# EAGLE design plant-sensor (EAGLE 9.5.1)
DESIGNER: Sander Huisman; PROJECT_NAME: Plant Sensor

## Sheet 1 of 5: Power
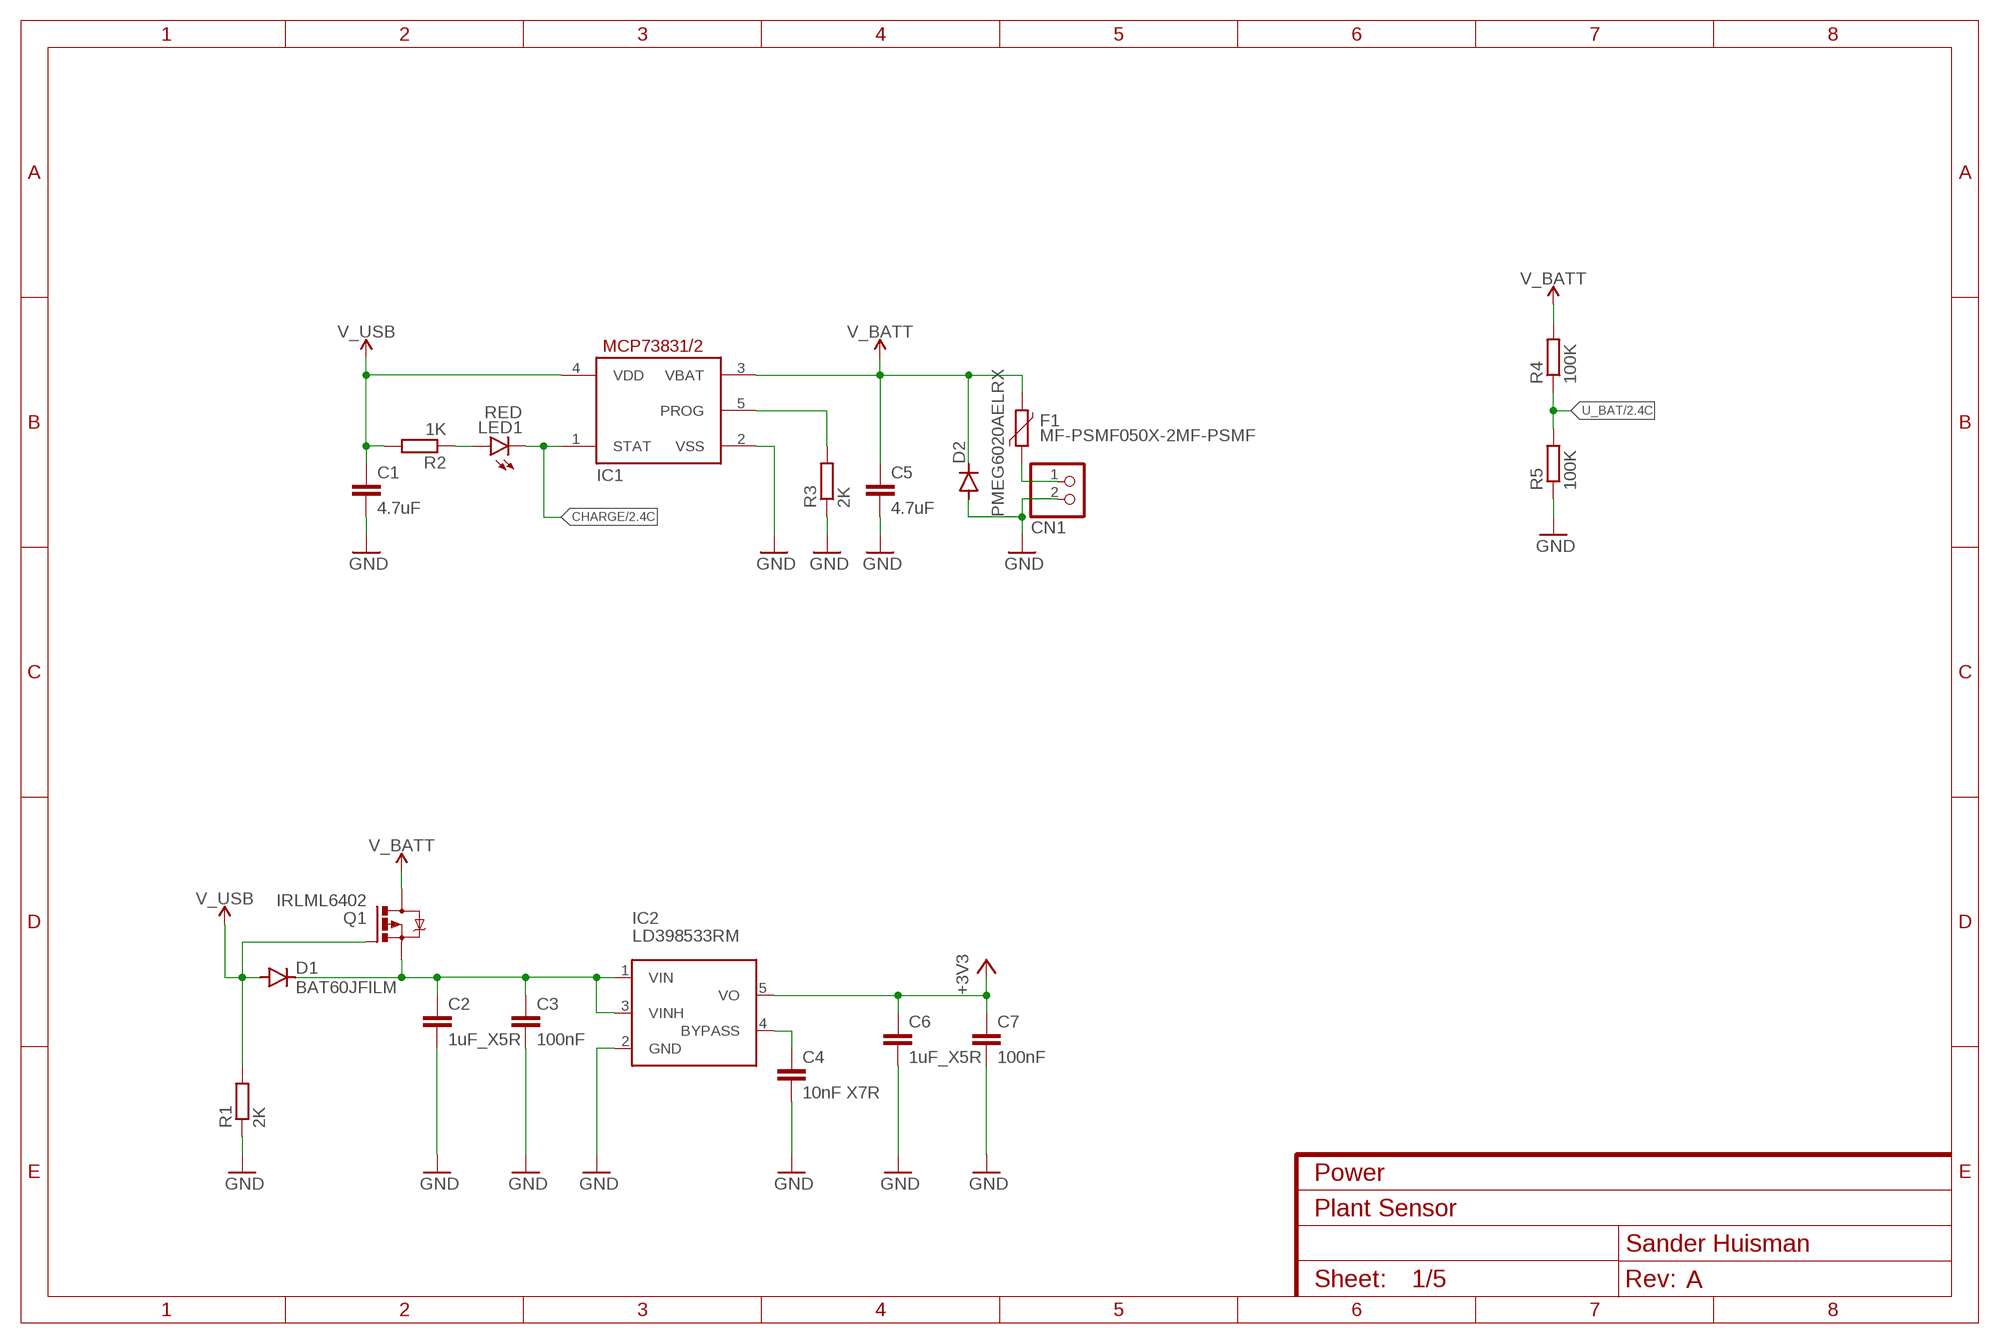
[diagram p0: schematic, sheet 1]
FRAME1 (FRAME-A4L): CNAME: Power; CREVISION: A

### Parts
C1  4.7uF  C-EUC0805  [C0805]
C2  1uF_X5R  C-EUC0805  [C0805]
C3  100nF  C-EUC0805  [C0805]
C4  10nF X7R  C-EUC0805  [C0805]
C5  4.7uF  C-EUC0805  [C0805]
C6  1uF_X5R  C-EUC0805  [C0805]
C7  100nF  C-EUC0805  [C0805]
CN1  JST_2PIN-SMT-RA  [JST-PH-2-SMT-RA]
D1  BAT60JFILM  DIODE-SOD323-W  [SOD323-W]
D2  PMEG6020AELRX  DIODE-SOD123  [SOD123]
F1  MF-PSMF050X-2MF-PSMF  [R0805]
IC1  MCP73831/OT  [SOT23-5L]
IC2  LD398533RM  [SOT23-5L]
LED1  RED  LEDCHIP-LED0805  [CHIP-LED0805]
Q1  IRLML6402  IRLML5203  [MICRO3]
R1  2K  R-EU_R0805  [R0805]
R2  1K  R-EU_R0805  [R0805]
R3  2K  R-EU_R0805  [R0805]
R4  100K  R-EU_R0805  [R0805]
R5  100K  R-EU_R0805  [R0805]

### Nets
+3V3: C6.1 C7.1 IC2.5(VO) ; also sheet 2,3,4
CHARGE [gnd]: IC1.1(STAT) LED1.C ; also sheet 2
GND [gnd]: C1.2 C2.2 C3.2 C4.2 C5.2 C6.2 C7.2 CN1.2 D2.A IC1.2(VSS) IC2.2(GND) R1.1 R3.1 R5.1 ; also sheet 2,3,4,5
N$2: CN1.1 F1.1
N$3: C2.1 C3.1 D1.C IC2.1(VIN) IC2.3(VINH) Q1.2(S)
N$4: LED1.A R2.1
N$5: IC1.5(PROG) R3.2
N$102: C4.1 IC2.4(BYPASS)
U_BAT: R4.1 R5.2 ; also sheet 2
V_BATT: C5.1 D2.C F1.2 IC1.3(VBAT) Q1.3(D) R4.2
V_USB: C1.1 D1.A IC1.4(VDD) Q1.1(G) R1.2 R2.2 ; also sheet 5

## Sheet 2 of 5: MCU
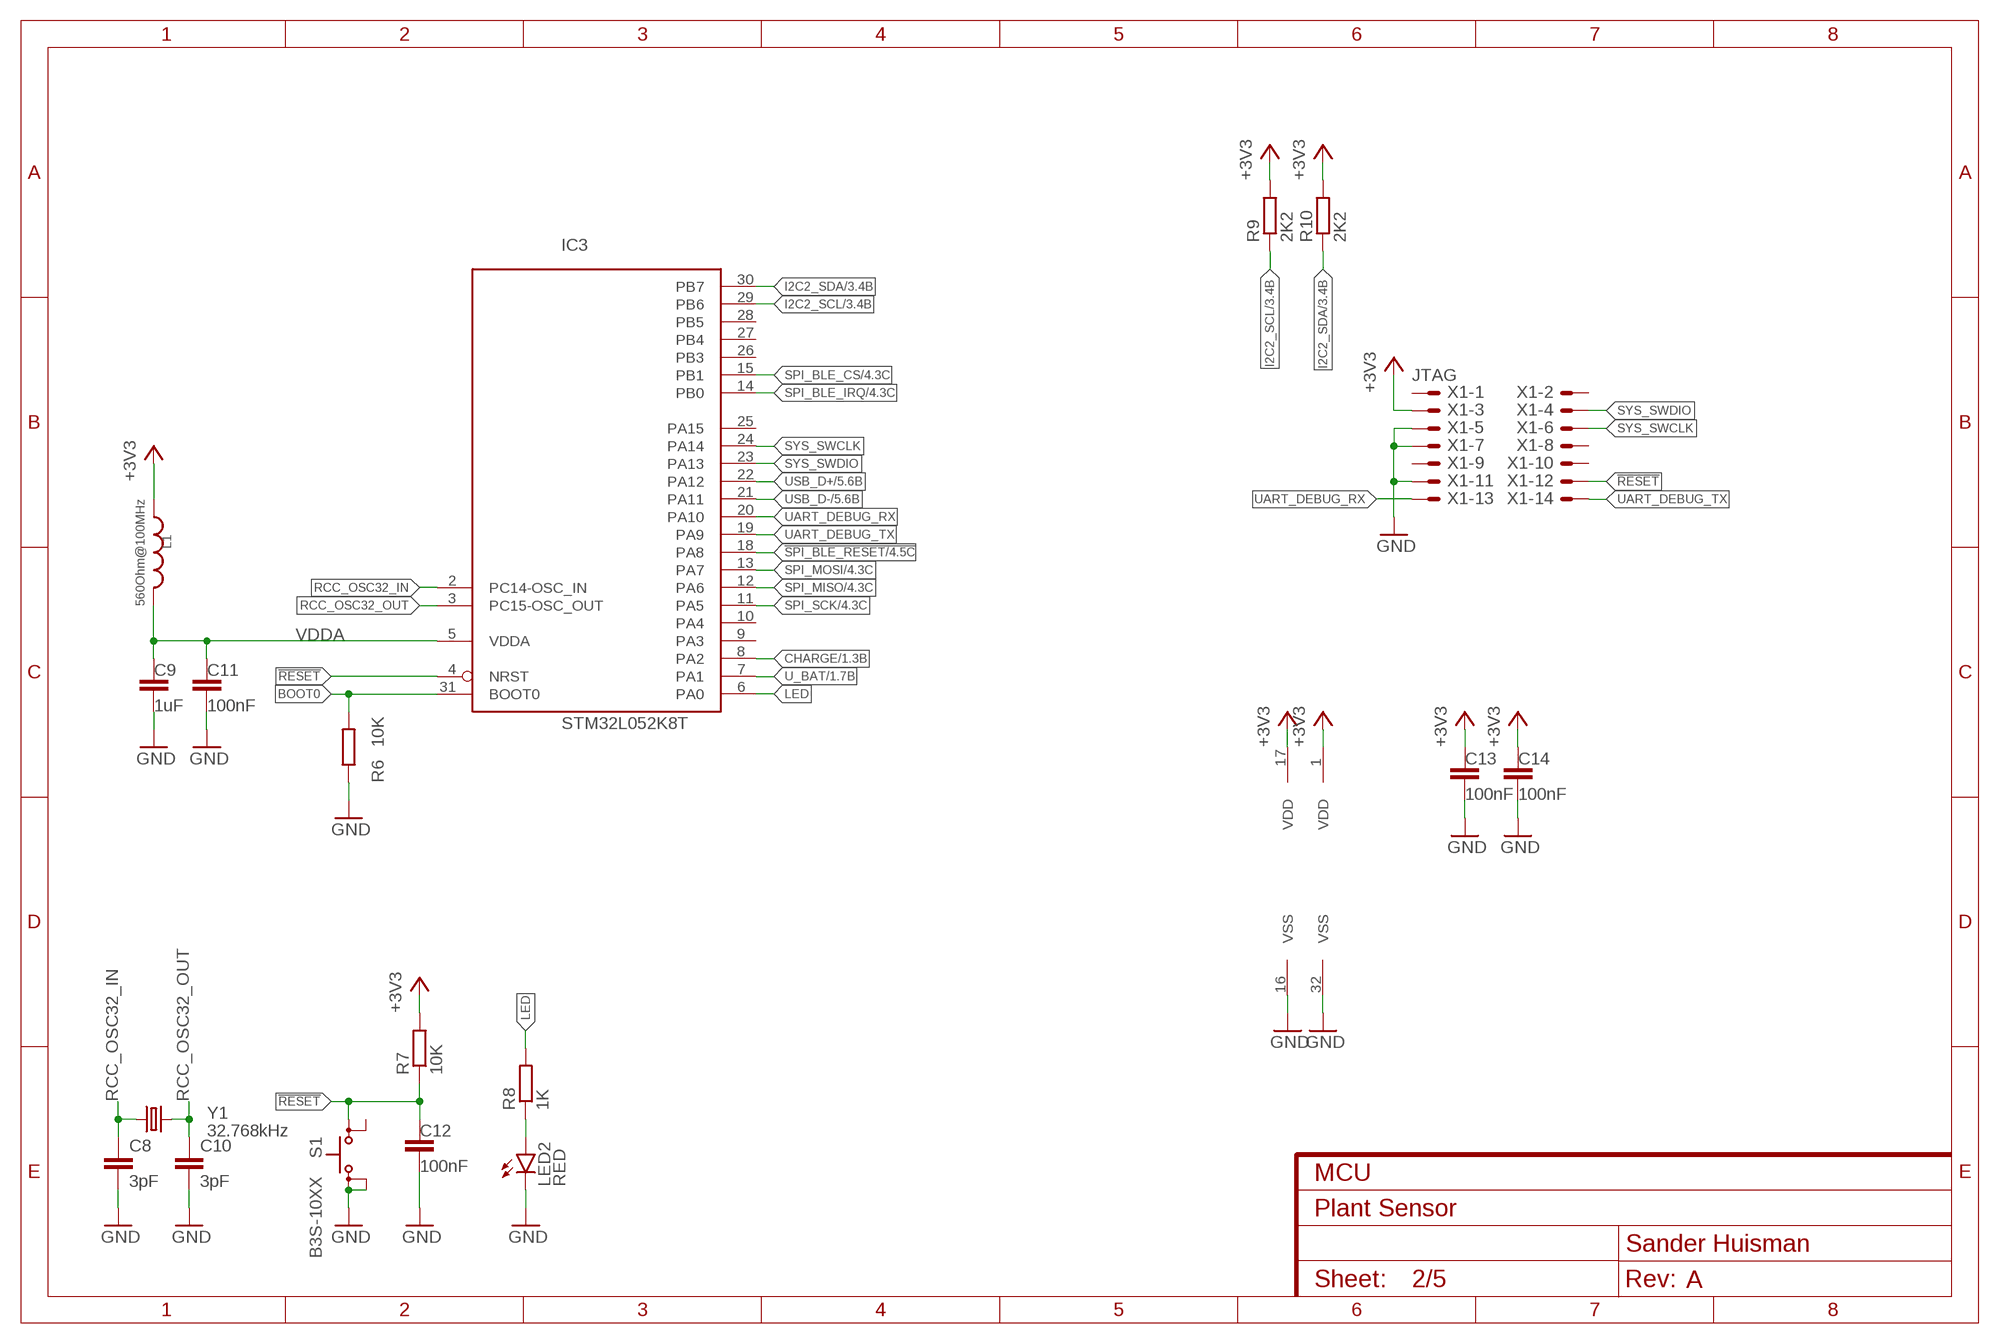
[diagram p1: schematic, sheet 2]
FRAME2 (FRAME-A4L): CNAME: MCU; CREVISION: A

### Parts
C8  3pF  C-EUC0805  [C0805]
C9  1uF  C-EUC0805  [C0805]
C10  3pF  C-EUC0805  [C0805]
C11  100nF  C-EUC0805  [C0805]
C12  100nF  C-EUC0805  [C0805]
C13  100nF  C-EUC0805  [C0805]
C14  100nF  C-EUC0805  [C0805]
IC3  STM32L052K8T  [LQFP32]
L1  560Ohm@100MHz  WE-CBA_0805_782853561_HC  [WE-CBA_0805(W=4)]
LED2  RED  LEDCHIP-LED0805  [CHIP-LED0805]
R6  10K  R-EU_R0805  [R0805]
R7  10K  R-EU_R0805  [R0805]
R8  1K  R-EU_R0805  [R0805]
R9  2K2  R-EU_R0805  [R0805]
R10  2K2  R-EU_R0805  [R0805]
S1  B3S-10XX  [B3S-10XX]
X1  JTAG  1365-14  [1365-14]
Y1  32.768kHz  ABS25-32.768KHZ-6-1-T  [XTAL_ABS25-32.768KHZ-6-1-T]

### Nets
!RESET: C12.2 IC3.4(NRST) R7.1 S1.1(P) X1.12
!SPI_BLE_RESET: IC3.18(PA8) ; also sheet 4
+3V3: C13.2 C14.2 IC3.17(VDD) L1.1 R7.2 R9.2 R10.2 X1.3 ; also sheet 1,3,4
BOOT0: IC3.31(BOOT0) R6.2
CHARGE [gnd]: IC3.8(PA2) ; also sheet 1
GND [gnd]: C8.2 C9.1 C10.2 C11.1 C12.1 C13.1 C14.1 IC3.16(VSS) IC3.32(VSS) LED2.C R6.1 S1.3(S) S1.4(S1) X1.5 X1.7 X1.11 ; also sheet 1,3,4,5
I2C2_SCL: IC3.29(PB6) R9.1 ; also sheet 3
I2C2_SDA: IC3.30(PB7) R10.1 ; also sheet 3
LED: IC3.6(PA0) R8.2
N$1: IC3.1(VDD) ; supply symbol labelled +3V3
N$9: LED2.A R8.1
RCC_OSC32_IN: C8.1 IC3.2(PC14-OSC_IN) Y1.1
RCC_OSC32_OUT: C10.1 IC3.3(PC15-OSC_OUT) Y1.4
SPI_BLE_CS: IC3.15(PB1) ; also sheet 4
SPI_BLE_IRQ: IC3.14(PB0) ; also sheet 4
SPI_MISO: IC3.12(PA6) ; also sheet 4
SPI_MOSI: IC3.13(PA7) ; also sheet 4
SPI_SCK: IC3.11(PA5) ; also sheet 4
SYS_SWCLK: IC3.24(PA14) X1.6
SYS_SWDIO: IC3.23(PA13) X1.4
U_BAT: IC3.7(PA1) ; also sheet 1
UART_DEBUG_RX: IC3.20(PA10) X1.13
UART_DEBUG_TX: IC3.19(PA9) X1.14
USB_D+ [usb]: IC3.22(PA12) ; also sheet 5
USB_D- [usb]: IC3.21(PA11) ; also sheet 5
VDDA: C9.2 C11.2 IC3.5(VDDA) L1.2
Unconnected: IC3.9(PA3) IC3.10(PA4) IC3.25(PA15) IC3.26(PB3) IC3.27(PB4) IC3.28(PB5) S1.2(P1) X1.1 X1.2 X1.8 X1.9 X1.10

## Sheet 3 of 5: Sensors
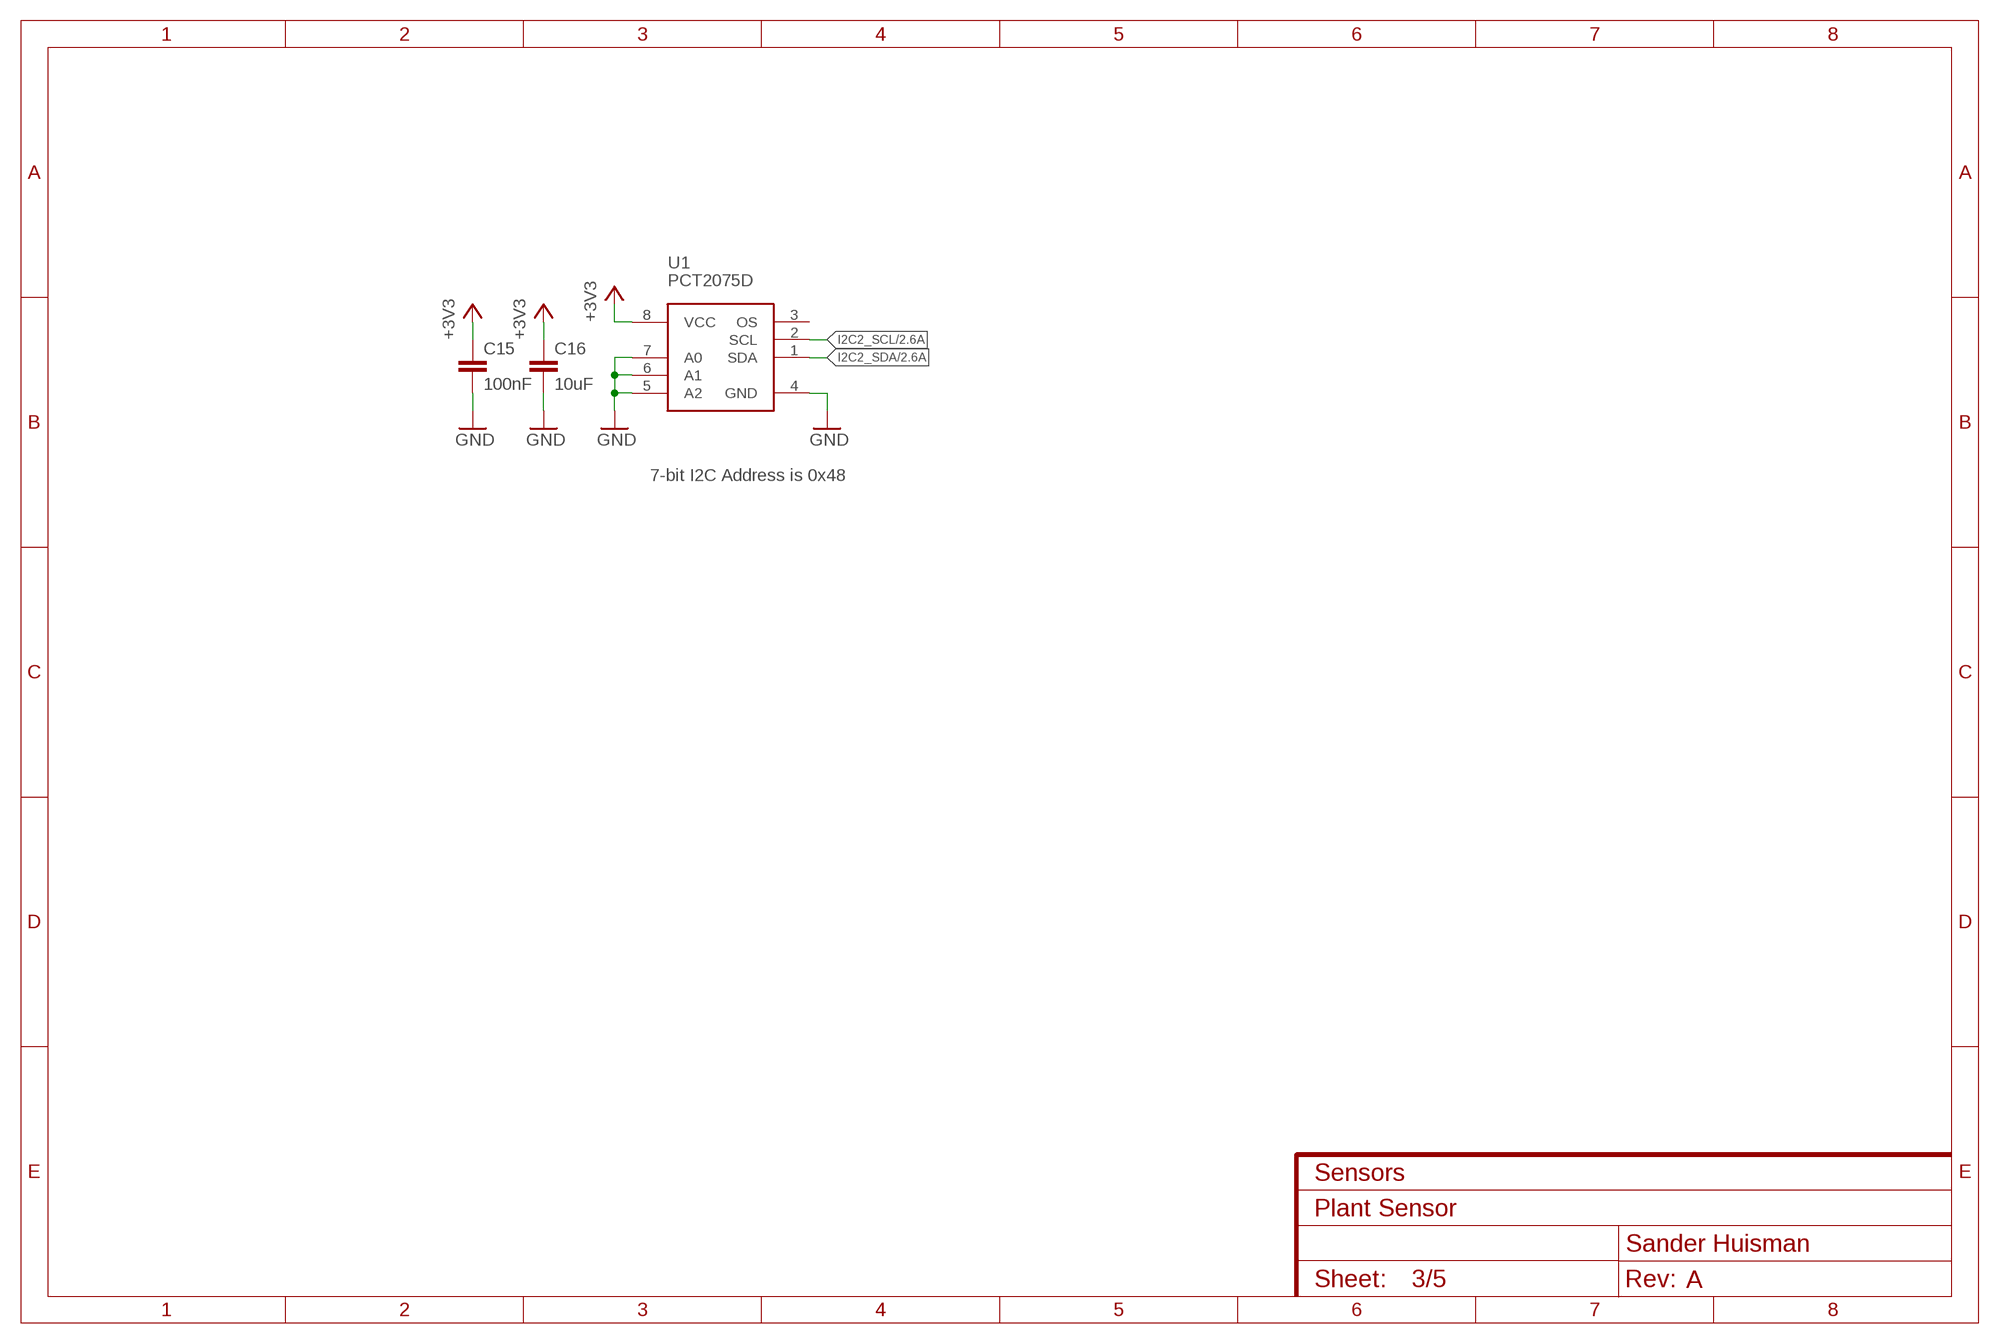
[diagram p2: schematic, sheet 3]
FRAME3 (FRAME-A4L): CNAME: Sensors; CREVISION: A

### Parts
C15  100nF  C-EUC0805  [C0805]
C16  10uF  C-EUC0805  [C0805]
U1  PCT2075D  [SOIC8_150MIL]

### Nets
+3V3: C15.1 C16.1 U1.8(VCC) ; also sheet 1,2,4
GND [gnd]: C15.2 C16.2 U1.4(GND) U1.5(A2) U1.6(A1) U1.7(A0) ; also sheet 1,2,4,5
I2C2_SCL: U1.2(SCL) ; also sheet 2
I2C2_SDA: U1.1(SDA) ; also sheet 2
Unconnected: U1.3(OS)

### Notes on the sheet
- 7-bit I2C Address is 0x48

## Sheet 4 of 5: BLE
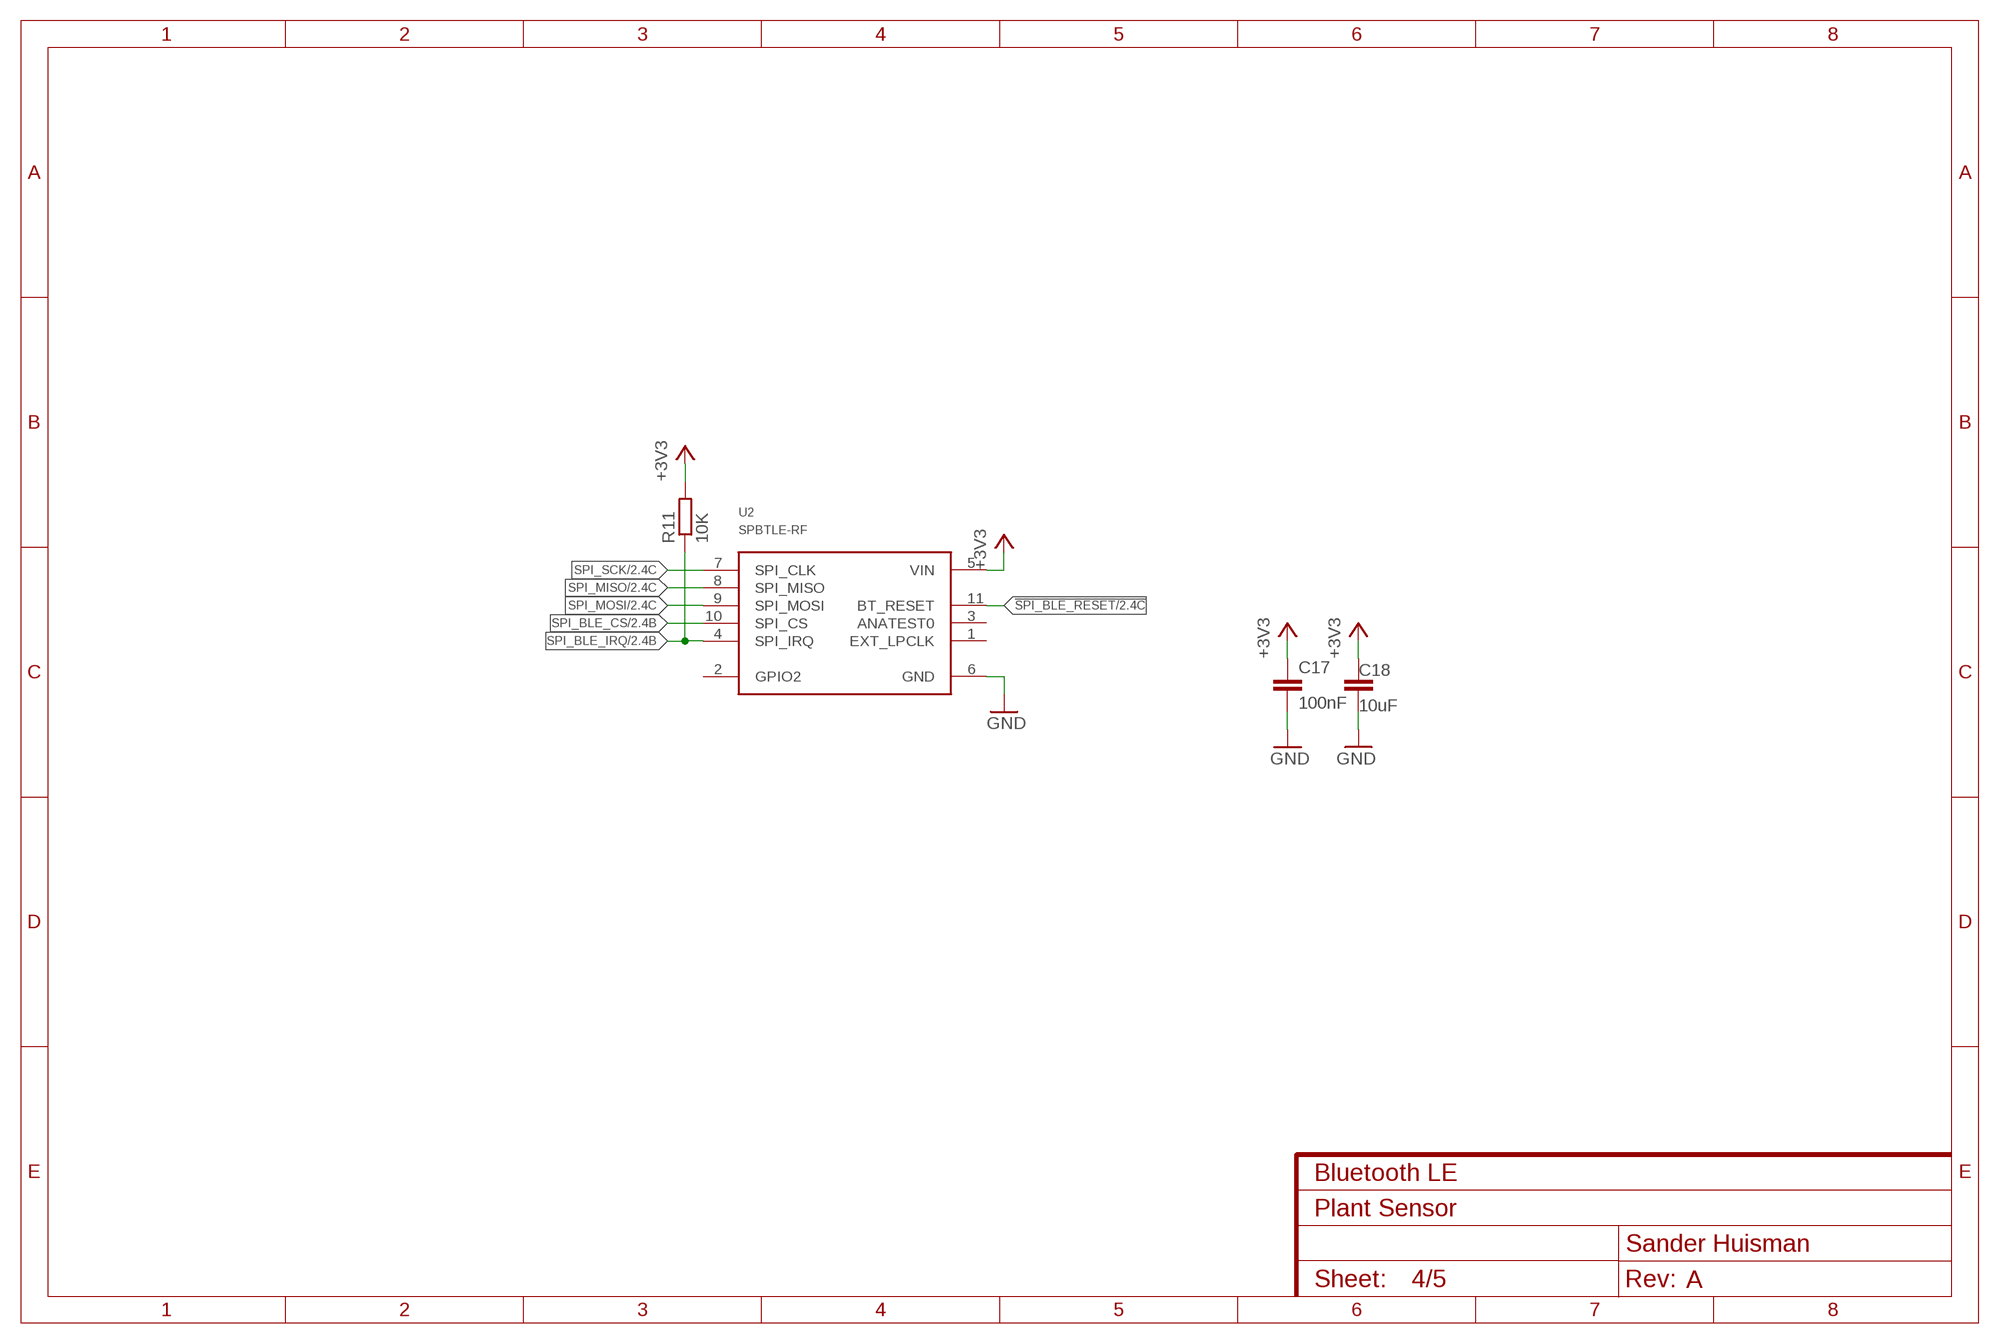
[diagram p3: schematic, sheet 4]
FRAME4 (FRAME-A4L): CNAME: Bluetooth LE; CREVISION: A

### Parts
C17  100nF  C-EUC0805  [C0805]
C18  10uF  C-EUC0805  [C0805]
R11  10K  R-EU_R0805  [R0805]
U2  SPBTLE-RF  [XCVR_SPBTLE-RF]

### Nets
!SPI_BLE_RESET: U2.11(BT_RESET) ; also sheet 2
+3V3: C17.1 C18.2 R11.2 U2.5(VIN) ; also sheet 1,2,3
GND [gnd]: C17.2 C18.1 U2.6(GND) ; also sheet 1,2,3,5
SPI_BLE_CS: U2.10(SPI_CS) ; also sheet 2
SPI_BLE_IRQ: R11.1 U2.4(SPI_IRQ) ; also sheet 2
SPI_MISO: U2.8(SPI_MISO) ; also sheet 2
SPI_MOSI: U2.9(SPI_MOSI) ; also sheet 2
SPI_SCK: U2.7(SPI_CLK) ; also sheet 2
Unconnected: U2.1(EXT_LPCLK) U2.2(GPIO2) U2.3(ANATEST0)

## Sheet 5 of 5: USB
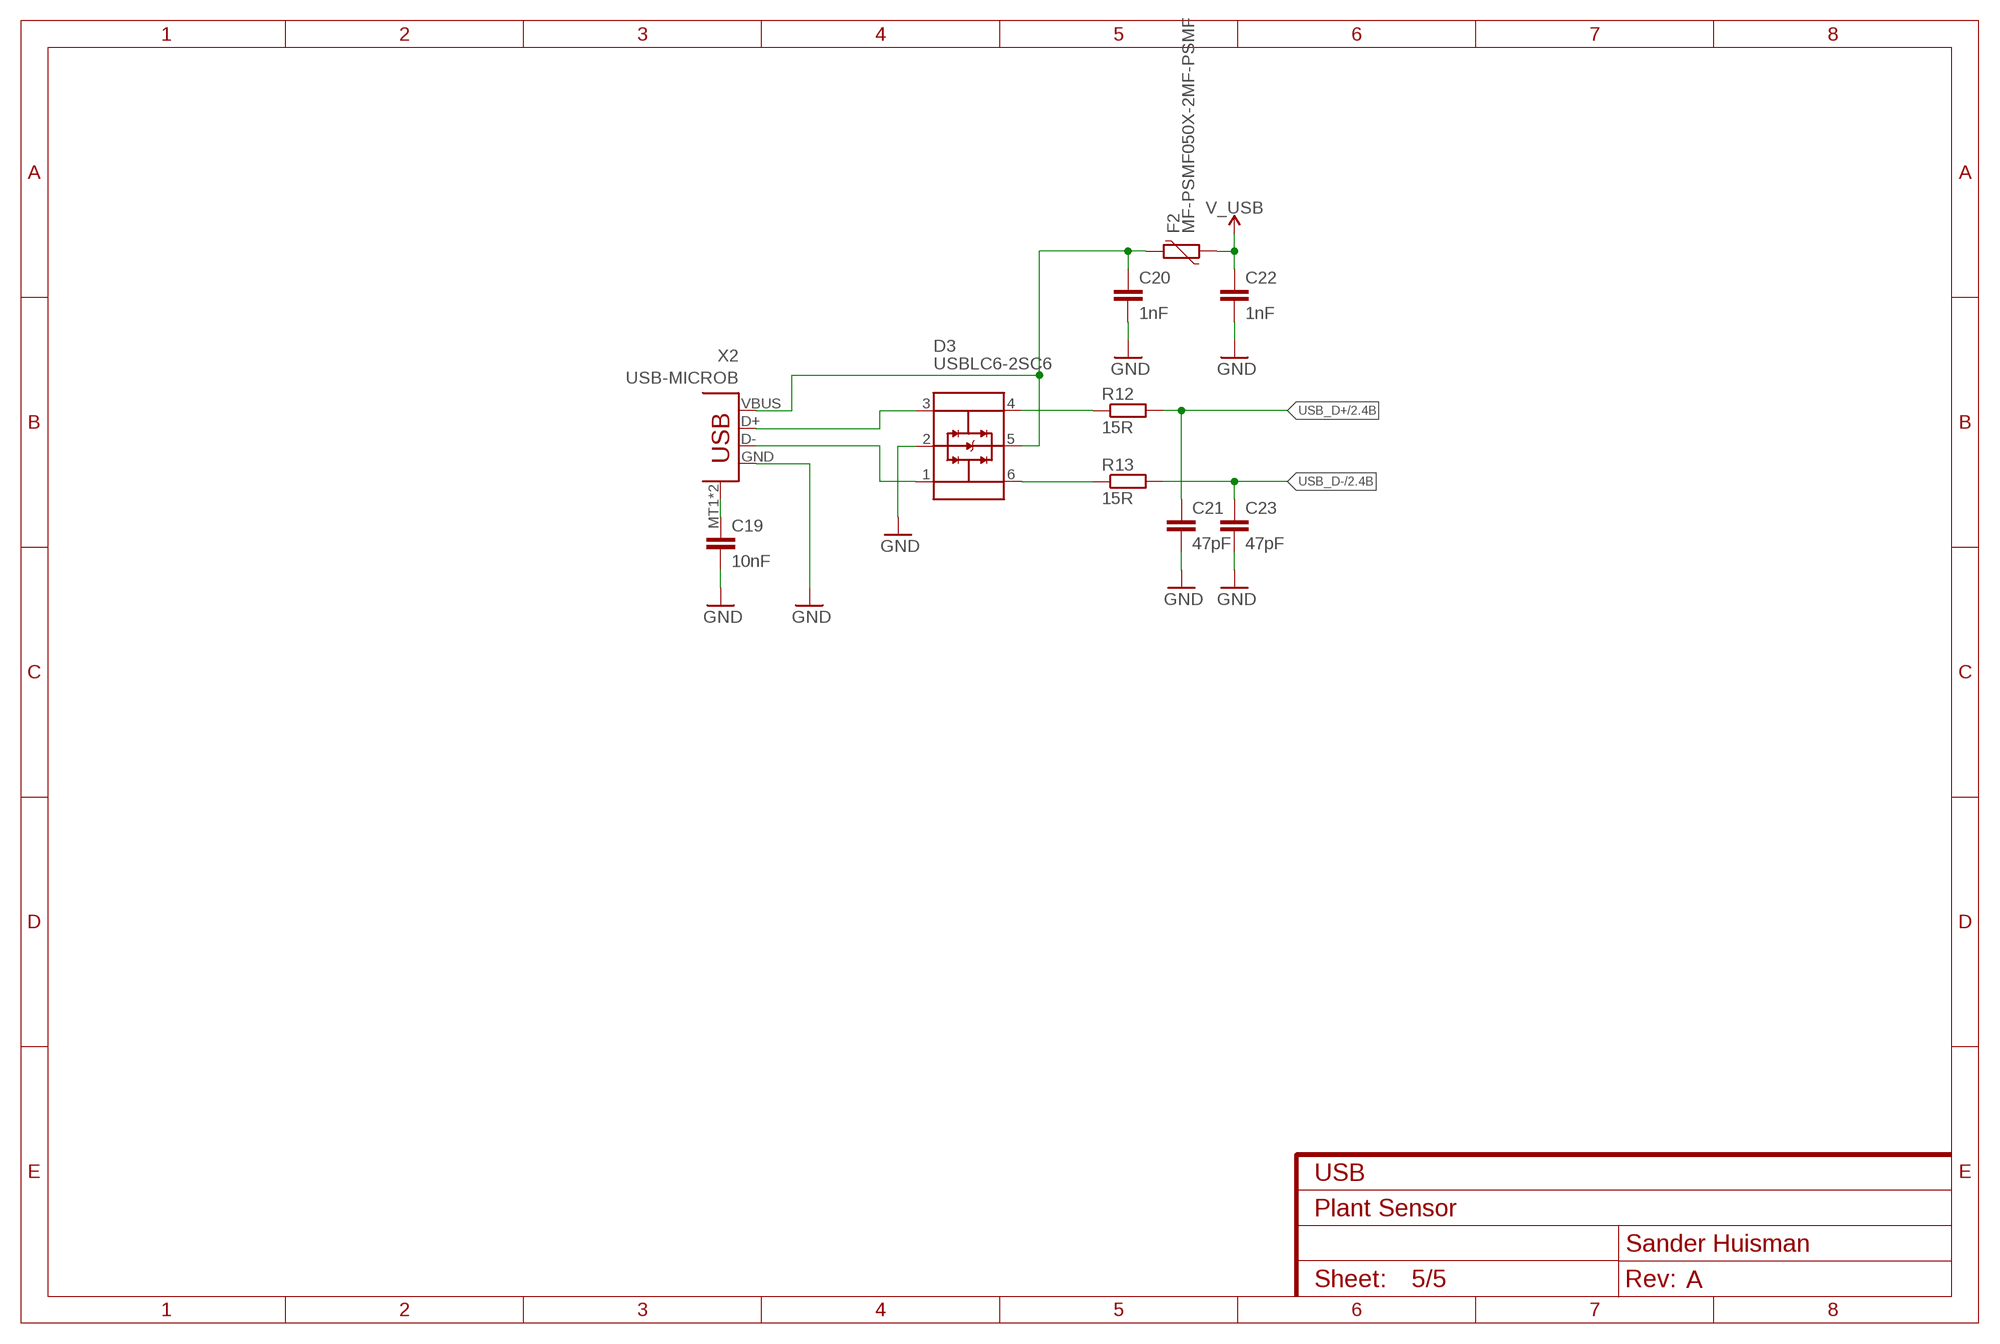
[diagram p4: schematic, sheet 5]
FRAME5 (FRAME-A4L): CNAME: USB; CREVISION: A

### Parts
C19  10nF  C-EUC0805  [C0805]
C20  1nF  C-EUC0805  [C0805]
C21  47pF  C-EUC0805  [C0805]
C22  1nF  C-EUC0805  [C0805]
C23  47pF  C-EUC0805  [C0805]
D3  USBLC6-2SC6  [SOT95P280X145-6N]
F2  MF-PSMF050X-2MF-PSMF  [R0805]
R12  15R  R-EU_R0805  [R0805]
R13  15R  R-EU_R0805  [R0805]
X2  USB-MICROB  [USB-MICROB]

### Nets
GND [gnd]: C19.2 C20.2 C21.2 C22.2 C23.2 D3.2(GND) X2.GND ; also sheet 1,2,3,4
N$6: C20.1 D3.5(VBUS) F2.2 X2.VBUS
N$7: D3.3(I/O2_1) X2.D+
N$8: C19.1 X2.MT1(MT) X2.MT2(MT)
N$22: D3.6(I/O1_2) R13.1
N$107: D3.1(I/O1_1) X2.D-
N$108: D3.4(I/O2_2) R12.1
USB_D+ [usb]: C21.1 R12.2 ; also sheet 2
USB_D- [usb]: C23.1 R13.2 ; also sheet 2
V_USB: C22.1 F2.1 ; also sheet 1

## Library data of the parts
C1-C23 = resistor:C-EU: CAPACITOR, European symbol
CN1 = adafruit:JST_2PIN: JST 2-Pin Connectors of various flavors SMT-RA (S2B-PH-SM4) 4UConnector #17311 SMT (B2B-PH-SM4) THM-RA (S2B-PH) THM (B2B-PH)
D1 D2 = diode:DIODE-: DIODE
D3 = clock:USBLC6-2SC6: USBLC6 Series 2 Line 6 V Uni / Bi-Directional ESD Protection - SOT-23-6; AVAILABILITY: Unavailable; DESCRIPTION: USBLC6 Series 2 Line 6 V Uni / Bi-Directional ESD Protection - SOT-23-6; MF: STMicroelectronics; MP: USBLC6-2SC6; PACKAGE: SOT-23-6 STMicroelectronics; PRICE: None
F1 F2 = custom:MF-PSMF050X-2: FUSE PTC RESET 500MA SMD 0805; DESCR: FUSE PTC RESET 500MA SMD 0603; MF: Bourns Inc; MPN: MF-FSMF050X-2
IC1 = adafruit:MCP73831: MCP73831/2 Miniature Single-Cell, Fully Integrated Li-Ion, Li-Polymer Charge Management Controllers. Nice and small simple lipoly charge controller, with adjustable current and status output (LED) http://www.ladyada.net/library/pcb/eaglelibrary.html
IC2 = st-microelectronics:LD3985: Ultra low drop and low noise BiCMOS voltage regulators Source: www.st.com LD3985.pdf
IC3 = micro-stm_v3:STM32L052K*T: ARM 32-bit Cortex™-M0+ CPU 32 MHz maximum frequency 32 to 64 Kbytes of Flash memory 2 kbyte of Data EEPROM 8 kbytes of SRAM 27 GPIOs 1.8 to 3.6 V application supply
L1 = Wurth_Automotive_WE-CBA:WE-CBA_0805: WE-CBA SMD EMI Suppression Ferrite Bead Characteristics Reliable Ni-Sn electrodes High rated current up to 5A Recommended soldering: Reflow Operating temperature: -55°C to +125°C Applications * Perfect as data line filter and for uncoupling of distribution voltage *This special SMD chip bead ferrites can be put directly on the printed circuit board. They offer excellent anti-EMI properties and low DC-resistance. Placed very close next to the interference source even with smallest size 0402,maximal impedance at 1000 Ω can be reached. *High Speed: "High Speed " SMD ferrites WE-CBF have lower impedance in the lower frequency ranges thus they have only a low attenuation for fast signals. Application e.g. USB 2.0, IEEE 1394,LVDS *Wide Band: "Wide Band" SMD ferrites WE-CBF already show high impedance in low frequency range. Therefore they are wide band through the whole spectrum. Application e.g. control signats, RS232, RS422, DC/DC converter *High Current: "High Current " SMD ferrites WE-CBF are designed for high current (over 1 A). The rated current refers to 40K self-heating. High current SMD ferrites are available in all there types (High Speed, Wide Band and High Frequency). Application e.g. power supply, DC/DC converter *Advice: Pay attention for the use of SMD-Ferrites for high current>1A and ambient temperature over +85°C that the rated current has to be reduced when temperature is above +85°C (Derating). *At+100°C environment temperature the maximal rated current has to add up to only 60% of the data sheet value ,without an overload of the component. Variant abbreviation WB means WIDE BAND HS means HIGH SPEED HC means HIGH CURRENT <https://katalog.we-online.de/media/images/v2/o14751v209%20Family_WE-CBA.jpg> Details see: https://katalog.we-online.de/en/am/WE-CBA Updated by Ella Wu 2019-09-09 2019(C) Wurth Elektronik; DATASHEET-URL: https://katalog.we-online.de/am/datasheet/782853561.pdf; IR1: 1500mA; MOUNT: SMT; PART-NUMBER: 782853561; RDC-MAX: 0.1Ohm; TYPE: High Current; ZMAX: 600Ohm
LED1 LED2 = led:LED: LED OSRAM: - CHIPLED LG R971, LG N971, LY N971, LG Q971, LY Q971, LO R971, LY R971 LH N974, LH R974 LS Q976, LO Q976, LY Q976 LO Q996 - Hyper CHIPLED LW Q18S LB Q993, LB Q99A, LB R99A - SideLED LS A670, LO A670, LY A670, LG A670, LP A670 LB A673, LV A673, LT A673, LW A673 LH A674 LY A675 LS A676, LA A676, LO A676, LY A676, LW A676 LS A679, LY A679, LG A679 - Hyper Micro SIDELED® LS Y876, LA Y876, LO Y876, LY Y876 LT Y87S - SmartLED LW L88C, LW L88S LB L89C, LB L89S, LG L890 LS L89K, LO L89K, LY L89K LS L896, LA L896, LO L896, LY L896 - TOPLED LS T670, LO T670, LY T670, LG T670, LP T670 LSG T670, LSP T670, LSY T670, LOP T670, LYG T670 LG T671, LOG T671, LSG T671 LB T673, LV T673, LT T673, LW T673 LH T674 LS T676, LA T676, LO T676, LY T676, LB T676, LH T676, LSB T676, LW T676 LB T67C, LV T67C, LT T67C, LS T67K, LO T67K, LY T67K, LW E67C LS E67B, LA E67B, LO E67B, LY E67B, LB E67C, LV E67C, LT E67C LW T67C LS T679, LY T679, LG T679 LS T770, LO T770, LY T770, LG T770, LP T770 LB T773, LV T773, LT T773, LW T773 LH T774 LS E675, LA E675, LY E675, LS T675 LS T776, LA T776, LO T776, LY T776, LB T776 LHGB T686 LT T68C, LB T68C - Hyper Mini TOPLED® LB M676 - Mini TOPLED Santana® LG M470 LS M47K, LO M47K, LY M47K Source: http://www.osram.convergy.de LUXEON: - LUMILED® LXK2-PW12-R00, LXK2-PW12-S00, LXK2-PW14-U00, LXK2-PW14-V00 LXK2-PM12-R00, LXK2-PM12-S00, LXK2-PM14-U00 LXK2-PE12-Q00, LXK2-PE12-R00, LXK2-PE12-S00, LXK2-PE14-T00, LXK2-PE14-U00 LXK2-PB12-K00, LXK2-PB12-L00, LXK2-PB12-M00, LXK2-PB14-N00, LXK2-PB14-P00, LXK2-PB14-Q00 LXK2-PR12-L00, LXK2-PR12-M00, LXK2-PR14-Q00, LXK2-PR14-R00 LXK2-PD12-Q00, LXK2-PD12-R00, LXK2-PD12-S00 LXK2-PH12-R00, LXK2-PH12-S00 LXK2-PL12-P00, LXK2-PL12-Q00, LXK2-PL12-R00 Source: www.luxeon.com KINGBRIGHT: KA-3528ASYC Source: www.kingbright.com
Q1 = transistor-power:IRLML5203: HEXFET P-Channel Power MOSFET
R1-R13 = resistor:R-EU_: RESISTOR, European symbol
S1 = custom:B3S-10XX: SMD Tactile Switch
U1 = custom:PCT2075D
U2 = custom:SPBTLE-RF: Very low power module for Bluetooth Smart v4.1; AVAILABILITY: Unavailable; DESCRIPTION: Very low power module for Bluetooth Smart v4.1; MF: STMicroelectronics; MP: SPBTLE-RF; PACKAGE: SMD-11 STMicroelectronics; PRICE: None
X1 = con-leotronics:1365-14: DUAL ROW STRAIGHT HEADER 1364 SERIES. 1.27mm x 1.27mm. Without Fixing Post. SMT Source: http://www.leotronics.co.uk/Conexcon/Data%20Sheets/sec.%20A/1364ing.pdf; OC_FARNELL: unknown; OC_NEWARK: unknown
X2 = custom:USB: USB Connectors USB-B-PTH is fully proven SKU : PRT-00139/CONN-08278 USB-miniB is fully proven SKU : PRT-00587 USB-A-H is throughly reviewed, but untested. Spark Fun Electronics SKU : PRT-00437 USB-B-SMT is throughly reviewed, but untested. Needs silkscreen touching up. USB-MICROB has been used. CONN-09505; PROD_ID: CONN-09505
Y1 = custom:ABS25-32.768KHZ-6-1-T: ABS25 Series 32.768 kHz ±10 ppm 6 pF -40 to +85 °C SMT Low Frequency Crystal; AVAILABILITY: Good; DESCRIPTION: CRYSTAL 32.7680KHZ 6PF SMD; MF: Abracon; MP: ABS25-32.768KHZ-6-1-T; PACKAGE: 4-4 Abracon; PRICE: 0.44 USD

## Net classes
2 gnd: width 0.203 mm, drill 0.559 mm, clearance 0.152 mm
5 usb: width 0.254 mm

## Board
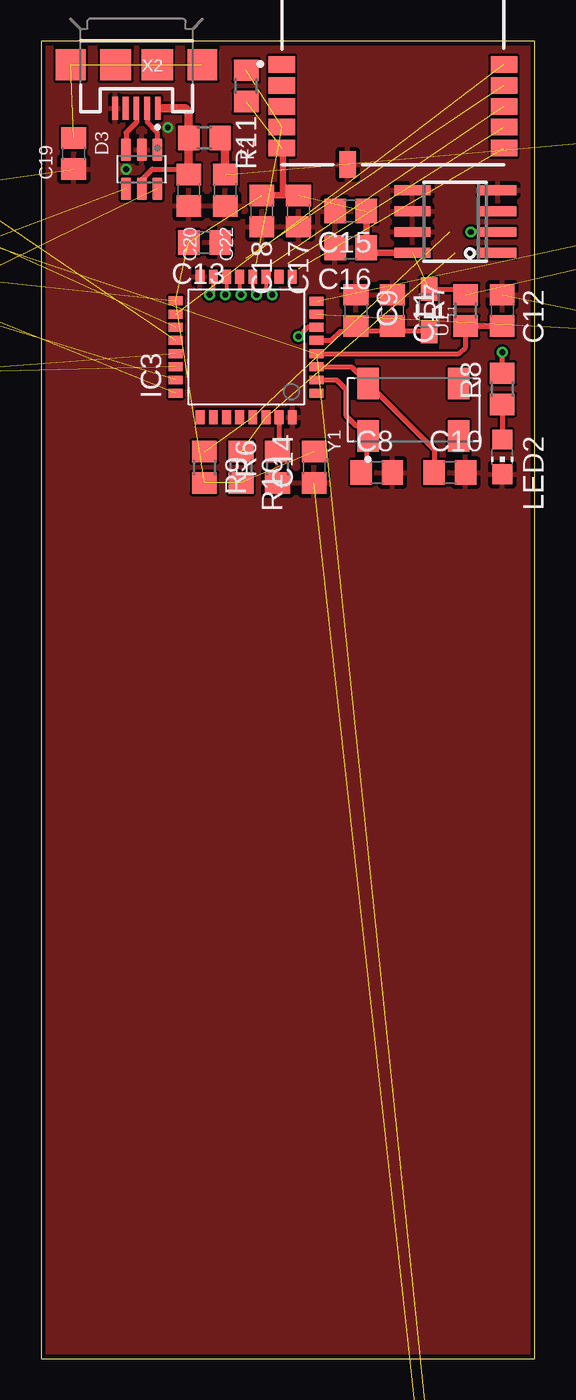
[diagram p5: board, top side]
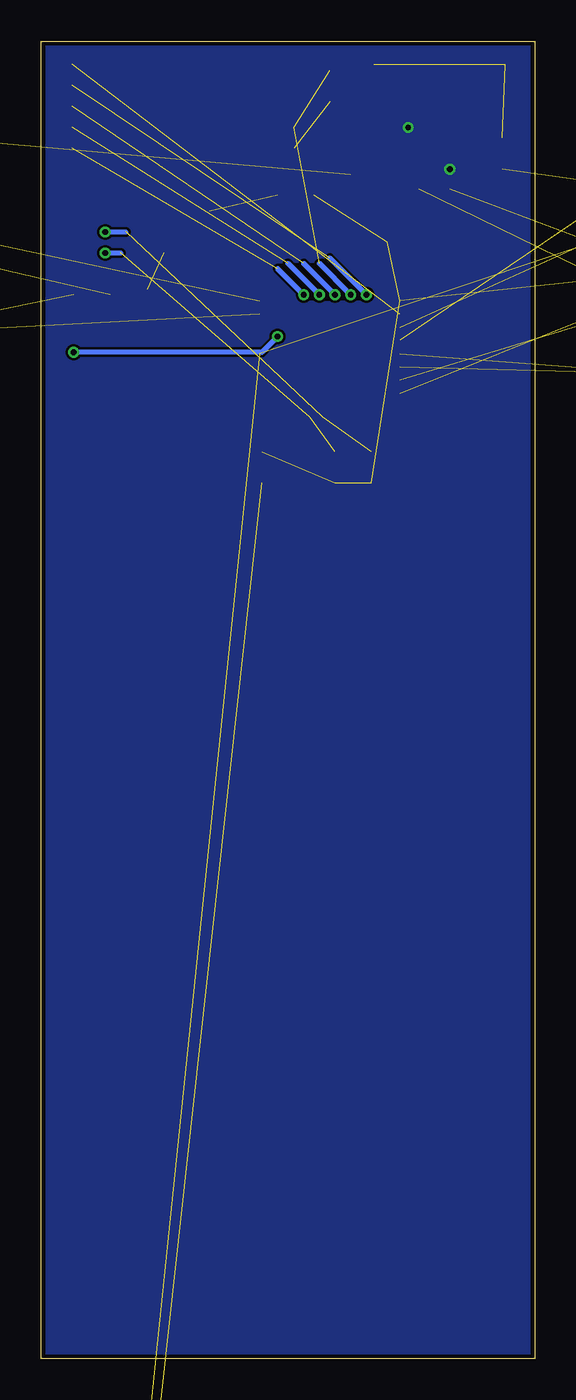
[diagram p6: board, bottom side, seen from below]

Size 30 x 80 mm. Coordinates in mm from the lower left corner, seen from the top.
Outline: 0,0 30,0 30,80 0,80 0,0
Copper layers (1*16): Top 0.035mm / dielectric 1.5mm / Bottom 0.035mm
Design rules "SeeedStudio_2layer_DRU_no_angle_20140221": minimum track width 6mil, minimum drill 12mil, track to track 6mil, track to pad 6mil, pad to pad 6mil, via to via 6mil, smd to smd 0mil, copper to edge 10mil, drill to drill 10mil, minimum pad ring 10mil, minimum via ring 6mil, stop-mask expansion 2mil, vias tented up to drill 100mil, thermal gap 10mil

### Footprints (pad centres in the part's own frame; a part is rotated, then mirrored left to right if it is on the bottom)
C0805 = smd 1.3 x 1.5: 1 -0.95,0; 2 0.95,0
JST-PH-2-SMT-RA = smd 1 x 4.6: 1 1,-3.7; 2 -1,-3.7 | smd 1.6 x 3.4: NC1 -3.4,1.5; NC2 3.4,1.5
SOD323-W = smd 1.5 x 1.2: A 1.45,0; C -1.45,0
SOD123 = smd 1.4 x 1.4: A 1.9,0; C -1.9,0
SOT95P280X145-6N = smd 1.36 x 0.6: 1 -1.175,0.95; 2 -1.175,0; 3 -1.175,-0.95; 4 1.175,-0.95; 5 1.175,0; 6 1.175,0.95
R0805 = smd 1.3 x 1.5: 1 -0.95,0; 2 0.95,0
SOT23-5L = smd 0.55 x 1.2: 1 -0.95,-1.3; 2 0,-1.3; 3 0.95,-1.3; 4 0.95,1.3; 5 -0.95,1.3
SOT23-5L' = smd 0.6 x 1.2: 1 -0.95,-1.15; 2 0,-1.15; 3 0.95,-1.15; 4 0.95,1.15; 5 -0.95,1.15
LQFP32 = smd 0.54 x 0.85: 1 -2.8,-4.275; 2 -2,-4.275; 3 -1.2,-4.275; 4 -0.4,-4.275; 5 0.4,-4.275; 6 1.19,-4.275; 7 1.99,-4.275; 8 2.79,-4.275; 17 2.8,4.275; 18 2,4.275; 19 1.2,4.275; 20 0.4,4.275; 21 -0.4,4.275; 22 -1.2,4.275; 23 -2,4.275; 24 -2.8,4.275 | smd 0.85 x 0.54: 9 4.275,-2.8; 10 4.275,-2; 11 4.275,-1.2; 12 4.275,-0.4; 13 4.275,0.4; 14 4.275,1.2; 15 4.275,2; 16 4.275,2.8; 25 -4.275,2.8; 26 -4.275,2; 27 -4.275,1.2; 28 -4.275,0.4; 29 -4.275,-0.4; 30 -4.275,-1.2; 31 -4.275,-2; 32 -4.275,-2.8
WE-CBA_0805(W=4) = smd 1.4 x 1: 1 -1.3,0; 2 1.3,0
CHIP-LED0805 = smd 1.2 x 1.2: A 0,-1.05; C 0,1.05
MICRO3 = smd 0.8 x 0.9: 1 -0.95,-1; 2 0.95,-1; 3 0,1
B3S-10XX = smd 1.75 x 1.4: 1 -4.15,2.25; 2 4.15,2.25; 3 -4.15,-2.25; 4 4.15,-2.25
SOIC8_150MIL = smd 0.6 x 2.2: 1 -1.905,-2.6; 2 -0.635,-2.6; 3 0.635,-2.6; 4 1.905,-2.6; 5 1.905,2.6; 6 0.635,2.6; 7 -0.635,2.6; 8 -1.905,2.6
XCVR_SPBTLE-RF = smd 1.6 x 1: 1 -6.75,0.33; 2 -6.75,-0.94; 3 -6.75,-2.21; 4 -6.75,-3.48; 5 -6.75,-4.75; 7 6.75,-4.75; 8 6.75,-3.48; 9 6.75,-2.21; 10 6.75,-0.94; 11 6.75,0.33 | smd 1 x 1.6: 6 -2.75,-5.75
1365-14 = smd 0.76 x 2.4: 1 -3.81,-2.95; 2 -3.81,2.95; 3 -2.54,-2.95; 4 -2.54,2.95; 5 -1.27,-2.95; 6 -1.27,2.95; 7 0,-2.95; 8 0,2.95; 9 1.27,-2.95; 10 1.27,2.95; 11 2.54,-2.95; 12 2.54,2.95; 13 3.81,-2.95; 14 3.81,2.95
USB-MICROB = smd 0.35 x 1.4: D+ 0,2.65; D- -0.65,2.65; GND 1.3,2.65; ID 0.65,2.65; VBUS -1.3,2.65 | smd 1.8 x 1.9: MT1 -4,0; MT2 4,0 | smd 1.9 x 1.9: P$1 -1.27,0; P$2 1.27,0
XTAL_ABS25-32.768KHZ-6-1-T = smd 1.9 x 1.3: 1 -1.6,2.75; 2 -1.6,-2.75; 3 1.6,-2.75; 4 1.6,2.75

### Placement (x,y rotation side)
C1  64.85,83.66 270 top  (outside the outline)
C2  138.19,84.92 0 top  (outside the outline)
C3  138.19,82.7 0 top  (outside the outline)
C4  141.37,88.42 270 top  (outside the outline)
C5  69.29,86.83 180 top  (outside the outline)
C6  135.01,88.42 270 top  (outside the outline)
C7  132.79,88.42 270 top  (outside the outline)
C8  20.4,53.81 0 top
C9  19.13,63.65 270 top
C10  24.84,53.81 0 top
C11  21.35,63.65 270 top
C12  28.02,63.65 270 top
C13  9.92,67.78 180 top
C14  16.59,54.13 90 top
C15  18.81,69.69 180 top
C16  18.81,67.46 180 top
C17  15.63,69.69 270 top
C18  13.41,69.69 90 top
C19  1.98,73.18 270 top
C20  8.97,70.95 270 top
C21  -33.38,59.15 0 top  (outside the outline)
C22  11.19,70.95 270 top
C23  -24.17,58.52 0 top  (outside the outline)
CN1  88.03,88.1 0 top  (outside the outline)
D1  124.86,85.88 180 top  (outside the outline)
D2  86.75,78.26 90 top  (outside the outline)
D3  6.11,72.22 270 top
F1  88.98,78.26 270 top  (outside the outline)
F2  9.92,74.13 180 top
IC1  69.29,83.66 90 top  (outside the outline)
IC2  LD398533RM  [SOT23-5L']  138.19,88.42 0 top  (outside the outline)
IC3  12.46,61.43 90 top
L1  23.57,63.65 270 top
LED1  65.48,74.45 90 top  (outside the outline)
LED2  28.02,54.76 180 top
Q1  124.86,88.73 0 top  (outside the outline)
R1  124.86,83.66 180 top  (outside the outline)
R2  65.8,76.67 180 top  (outside the outline)
R3  69.29,80.48 180 top  (outside the outline)
R4  42.3,61.11 270 top  (outside the outline)
R5  47.07,60.48 180 top  (outside the outline)
R6  14.37,54.13 90 top
R7  25.8,63.65 90 top
R8  28.02,58.89 90 top
R9  9.92,54.13 270 top
R10  12.14,54.13 270 top
R11  12.46,77.28 270 top
R12  -33.38,56.93 180 top  (outside the outline)
R13  -24.17,56.3 180 top  (outside the outline)
S1  28.97,-19.53 0 top  (outside the outline)
U1  25.16,69.05 90 top
U2  21.37,78.26 0 top
X1  -10.08,68.41 90 top  (outside the outline)
X2  5.79,78.58 180 top
Y1  22.62,57.62 90 top

### Tracks (layer width: path | path; a pad name or v marks a point on that pad's centre or on a via)
!RESET  (2 unrouted)
  Top 0.305: C12.2 R7.1 25.8,61.43 25.39,61.03 IC3.4
!SPI_BLE_RESET  (1 unrouted)
+3V3  (12 unrouted)
  Top 0.305: R7.2 25.48,64.92 23.6,64.92 L1.1
  Top 0.406: C15.1 C16.1 20.08,67.14 U1.8 | C18.2 14.68,70.64 | 14.68,70.64 C17.1 | U2.5 14.68,73.45 14.68,70.64
BOOT0
  Top 0.305: IC3.31 14.46,55.17 R6.2
CHARGE  (2 unrouted)
GND  (via drill 0.35)  (21 unrouted)
  other vias: 5.16,72.22 7.7,74.77
  pour Top: -1,151 31,151 31,-1 -1,-1
  pour Bottom: -2,86 32,86 32,-2 -2,-2
I2C2_SCL  (via drill 0.35)  (2 unrouted)
  Top 0.305: U1.2 v26.11,68.41
  Bottom 0.305: v26.11,68.41 24.84,68.41
I2C2_SDA  (via drill 0.35)  (2 unrouted)
  Top 0.305: U1.1 v26.11,67.14
  Bottom 0.305: v26.11,67.14 25.16,67.14
LED  (via drill 0.35)
  Top 0.305: R8.2 v28.02,61.11 | IC3.6 16.19,62.62 v15.63,62.06
  Bottom 0.305: v15.63,62.06 16.59,61.11 v28.02,61.11
N$2  (1 unrouted)
N$3  (5 unrouted)
N$4  (1 unrouted)
N$5  (1 unrouted)
N$6
  Top 0.305: D3.5 6.11,71.59 6.74,72.22 8.65,72.22 C20.1 | F2.2 | 7.38,75.92 X2.VBUS
  Top 0.508: C20.1 F2.2 8.97,75.72 8.76,75.92 7.38,75.92
N$7
  Top 0.305: X2.D+ 5.79,75.08 5.16,74.45 D3.3
N$8  (2 unrouted)
N$9
  Top 0.305: R8.1 LED2.A
N$22  (1 unrouted)
N$102  (1 unrouted)
N$107
  Top 0.305: X2.D- 6.44,75.07 7.06,74.45 D3.1
N$108  (1 unrouted)
RCC_OSC32_IN
  Top 0.305: IC3.2 17.95,59.43 18.49,58.89 18.49,57.3 19.14,56.66 19.76,56.66 19.76,56.02 | 19.76,56.02 Y1.1 | C8.1 19.76,54.12 19.76,56.02
RCC_OSC32_OUT
  Top 0.305: IC3.3 18.86,60.23 Y1.4 23.89,55.2 C10.1
SPI_BLE_CS  (via drill 0.35)  (1 unrouted)
  Top 0.254: IC3.15 10.46,64.83 v10.24,64.61
  Bottom 0.305: v10.24,64.61 12.46,66.83
SPI_BLE_IRQ  (via drill 0.35)  (2 unrouted)
  Top 0.254: IC3.14 11.26,64.67 v11.19,64.61
  Bottom 0.305: v11.19,64.61 13.1,66.51
SPI_MISO  (via drill 0.35)  (1 unrouted)
  Top 0.254: IC3.12 12.86,64.84 v13.1,64.61
  Bottom 0.305: v13.1,64.61 15,66.51
SPI_MOSI  (via drill 0.35)  (1 unrouted)
  Top 0.254: IC3.13 12.06,64.69 v12.14,64.61
  Bottom 0.305: v12.14,64.61 14.05,66.51
SPI_SCK  (via drill 0.35)  (1 unrouted)
  Top 0.254: IC3.11 13.66,64.99 v14.05,64.61
  Bottom 0.305: v14.05,64.61 15.63,66.19
SYS_SWCLK  (1 unrouted)
SYS_SWDIO  (1 unrouted)
U_BAT  (2 unrouted)
UART_DEBUG_RX  (1 unrouted)
UART_DEBUG_TX  (1 unrouted)
USB_D+  (2 unrouted)
USB_D-  (2 unrouted)
V_BATT  (5 unrouted)
V_USB  (6 unrouted)
  Top 0.508: F2.1 10.87,73.81 11.19,73.5 C22.1
VDDA
  Top 0.305: L1.2 23.54,62.38 21.67,62.38 C11.2 21.03,62.38 19.45,62.38 C9.2 18.81,62.38 18.18,62.38 17.62,61.83 IC3.5